# Altium schematic sheet I2C-IOexpander 16bit.SchDoc
size Letter
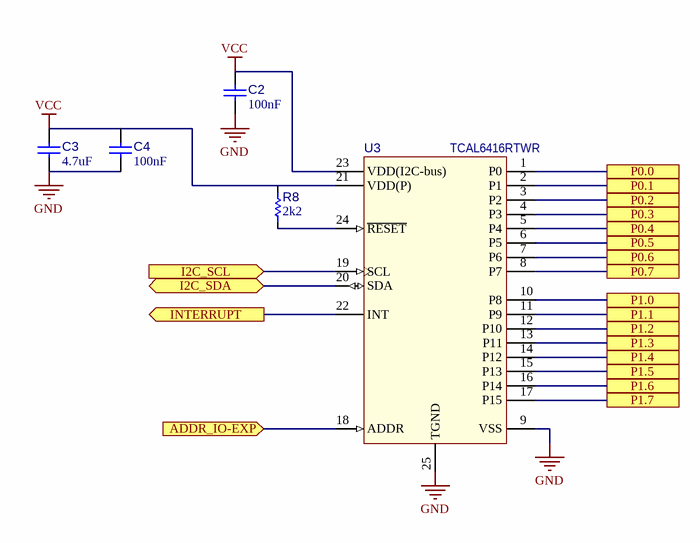
[diagram p0: I2C-IOexpander 16bit.SchDoc]

## Parts
C2  value 100nF  [C_1005[0402]]  (hidden comment: Cap 100nF 0402)
C3  value 4.7uF  [C_2012[0805]]  (hidden comment: Cap 4.7uF 0805)
C4  value 100nF  [C_1005[0402]]  (hidden comment: Cap 100nF 0402)
R8  value 2k2  [R_1005[0402]]  (hidden comment: Res 2k2 1% 0402)
U3  TCAL6416RTWR  [U_QFN50P400X400X90-24L]

## Ports
ADDR_IO-EXP (in, see 243-336_MP_Manette[1B]), I2C_SCL (in, see 243-336_MP_Manette[1B], 243-336_MP_3D_Accelerometer[1C]), I2C_SDA (bidir, see 243-336_MP_Manette[1B], 243-336_MP_3D_Accelerometer[1C]), INTERRUPT (out, see 243-336_MP_Manette[1B]), P0.0 (see 243-336_MP_Manette[1A]), P0.1 (see 243-336_MP_Manette[1A]), P0.2 (see 243-336_MP_Manette[1A]), P0.3 (see 243-336_MP_Manette[1A]), P0.4 (see 243-336_MP_Manette[1B]), P0.5 (see 243-336_MP_Manette[1B]), P0.6 (see 243-336_MP_Manette[1B]), P0.7 (see 243-336_MP_Manette[1B]), P1.0 (see 243-336_MP_Manette[1B]), P1.1 (see 243-336_MP_Manette[1B]), P1.2 (see 243-336_MP_Manette[1B]), P1.3 (see 243-336_MP_Manette[1B]), P1.4 (see 243-336_MP_Manette[1B]), P1.5 (see 243-336_MP_Manette[1B]), P1.6 (see 243-336_MP_Manette[1B]), P1.7 (see 243-336_MP_Manette[1B])

## Nets
GND: C2.1 C3.1 C4.1 U3.9(VSS) U3.25(TGND)
VCC: C2.2 C3.2 C4.2 R8.2 U3.21(VDD(P)) U3.23(VDD(I2C-bus))
ADDR_IO-EXP: U3.18(ADDR) ; port ADDR_IO-EXP
I2C_SCL: U3.19(SCL) ; port I2C_SCL
I2C_SDA: U3.20(SDA) ; port I2C_SDA
INTERRUPT: U3.22(INT) ; port INTERRUPT
P0.0: U3.1(P0) ; port P0.0
P0.1: U3.2(P1) ; port P0.1
P0.2: U3.3(P2) ; port P0.2
P0.3: U3.4(P3) ; port P0.3
P0.4: U3.5(P4) ; port P0.4
P0.5: U3.6(P5) ; port P0.5
P0.6: U3.7(P6) ; port P0.6
P0.7: U3.8(P7) ; port P0.7
P1.0: U3.10(P8) ; port P1.0
P1.1: U3.11(P9) ; port P1.1
P1.2: U3.12(P10) ; port P1.2
P1.3: U3.13(P11) ; port P1.3
P1.4: U3.14(P12) ; port P1.4
P1.5: U3.15(P13) ; port P1.5
P1.6: U3.16(P14) ; port P1.6
P1.7: U3.17(P15) ; port P1.7
NetR8_1: R8.1 U3.24(~{RESET})

## Library data of the parts
C2 C4 = CAP001: Capacitor type 1; Manufacturer 1: Taiyo Yuden; Manufacturer Part Number 1: UMK105B7104KV-FR; LibRef: CAP001; CEGEP: KCOND01SM; Tolerance: 10%; Rated Voltage: 50V; Dielectric: X7R; Supplier 1: LCSC; Supplier Part Number 1: C2167491; Mounting Technology: SMT
C3 = CAP003: Capacitor type 1; Manufacturer 1: Taiyo Yuden; Manufacturer Part Number 1: TMK212AB7475KG-T; LibRef: CAP003; CEGEP: KCOND02SM; Tolerance: 10%; Rated Voltage: 25V; Dielectric: X7R; Supplier 1: LCSC; Supplier Part Number 1: C163186; Mounting Technology: SMT
R8 = RES008: Resistor type 1; Manufacturer 1: Yageo; Manufacturer Part Number 1: RC0402FR-072K2L; LibRef: RES008; Puissance: 1/16W; Max Working Voltage: 50V; Tolerance: 1%; Supplier 1: LCSC; Supplier Part Number 1: C114762; Supplier 2: Digi-Key; Supplier Part Number 2: 311-2.20KLRCT-ND; Mounting Technology: SMT
U3 = U_PCAL6416AHF: IC I/O EXPANDER 16BIT  QFN24; Manufacturer 1: Texas Instrument; Value: TCA6416ARTWR; Manufacturer 2: NXP; Manufacturer Part Number 1: TCAL6416RTWR; Manufacturer Part Number 2: PCAL6416AHF,128; Mounting Technology: SMT; Supplier 1: LCSC; Supplier 2: LCSC; Supplier 3: Digikey; Supplier Part Number 1: C5956642; Supplier Part Number 2: C2652287; Supplier Part Number 3: 568-9946-1-ND